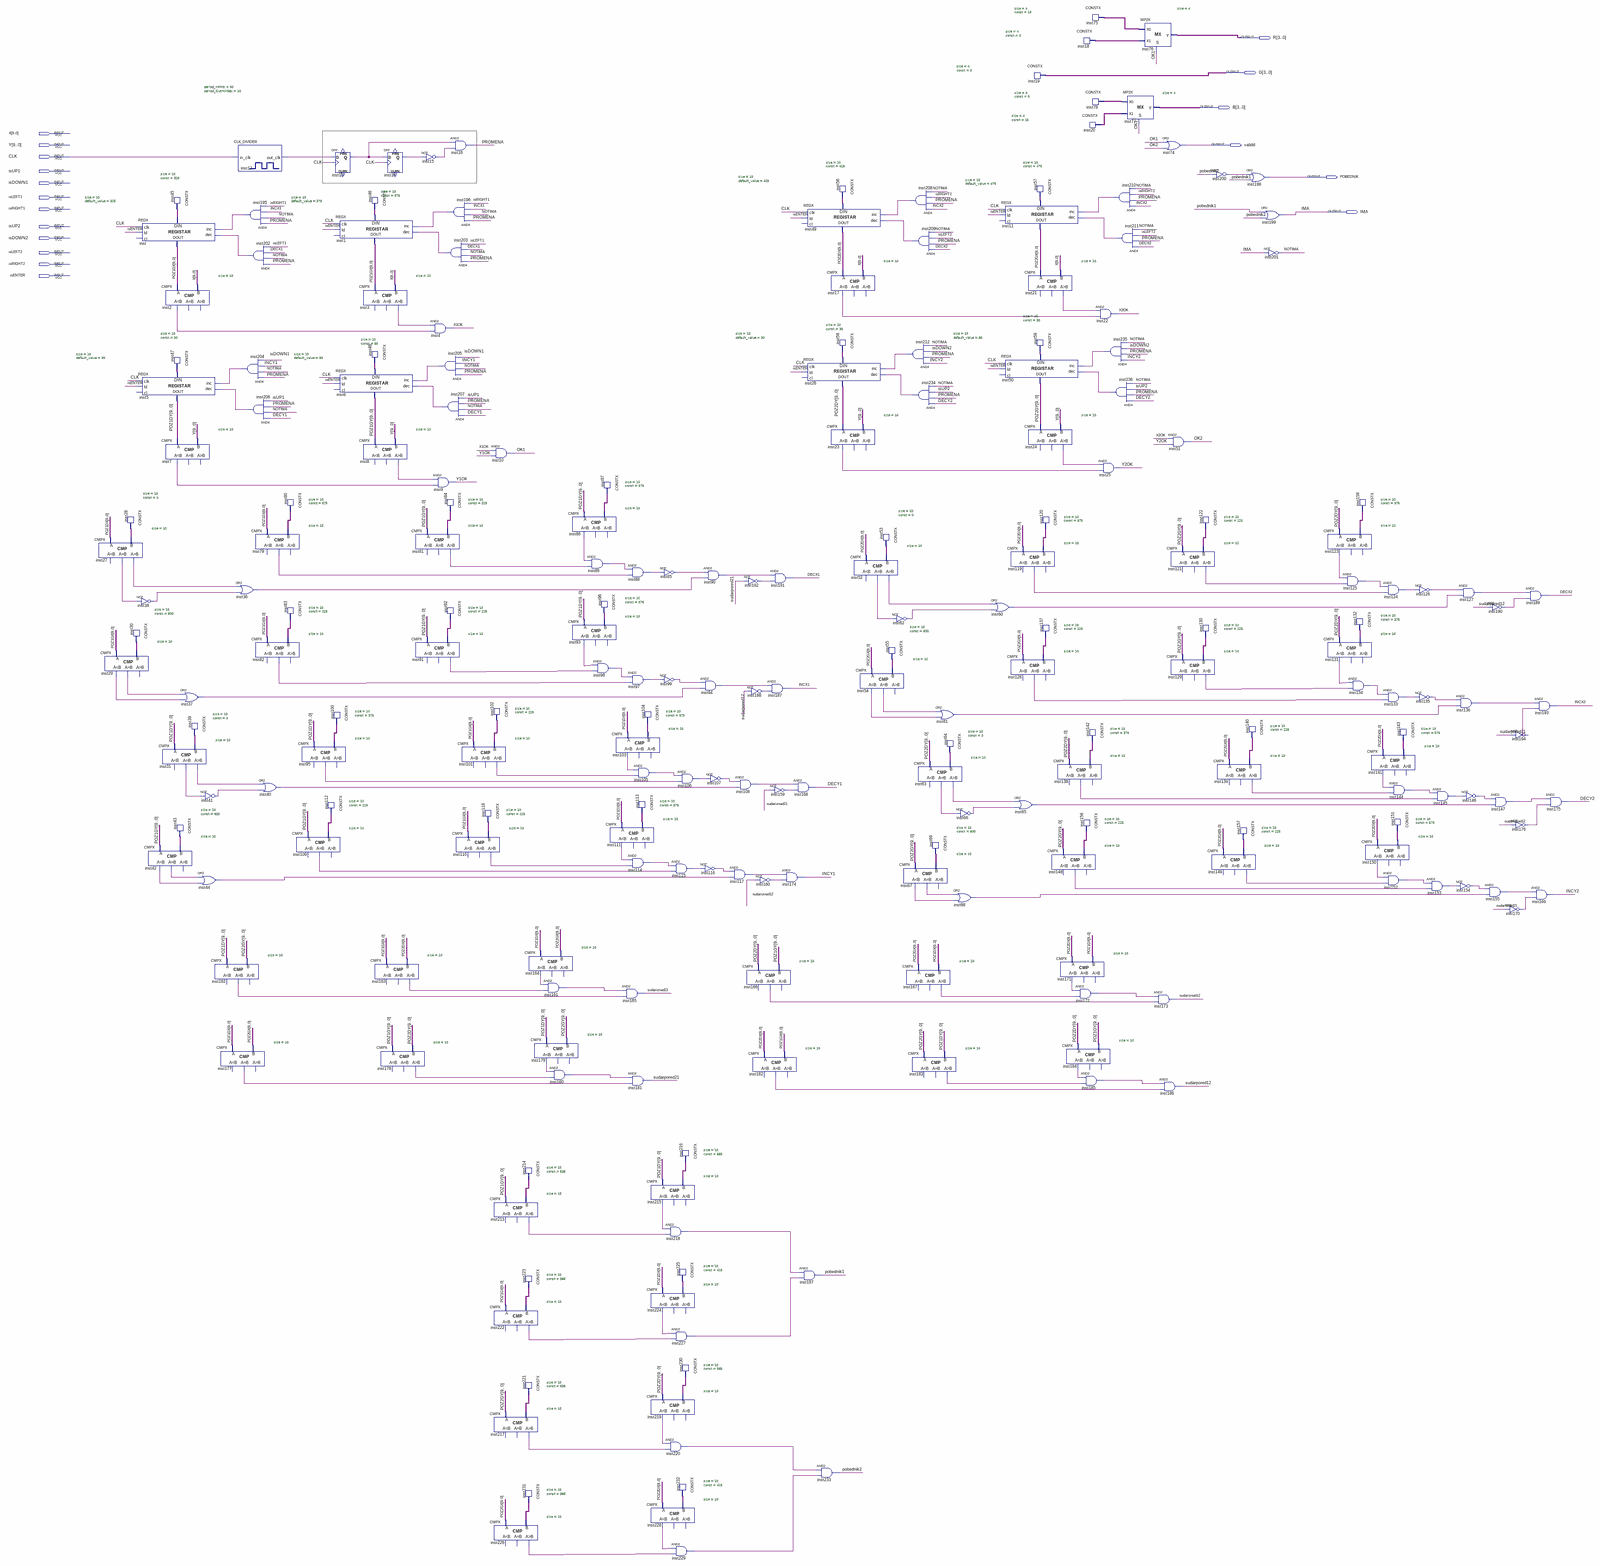
[diagram p0: schematic sheet, whole]
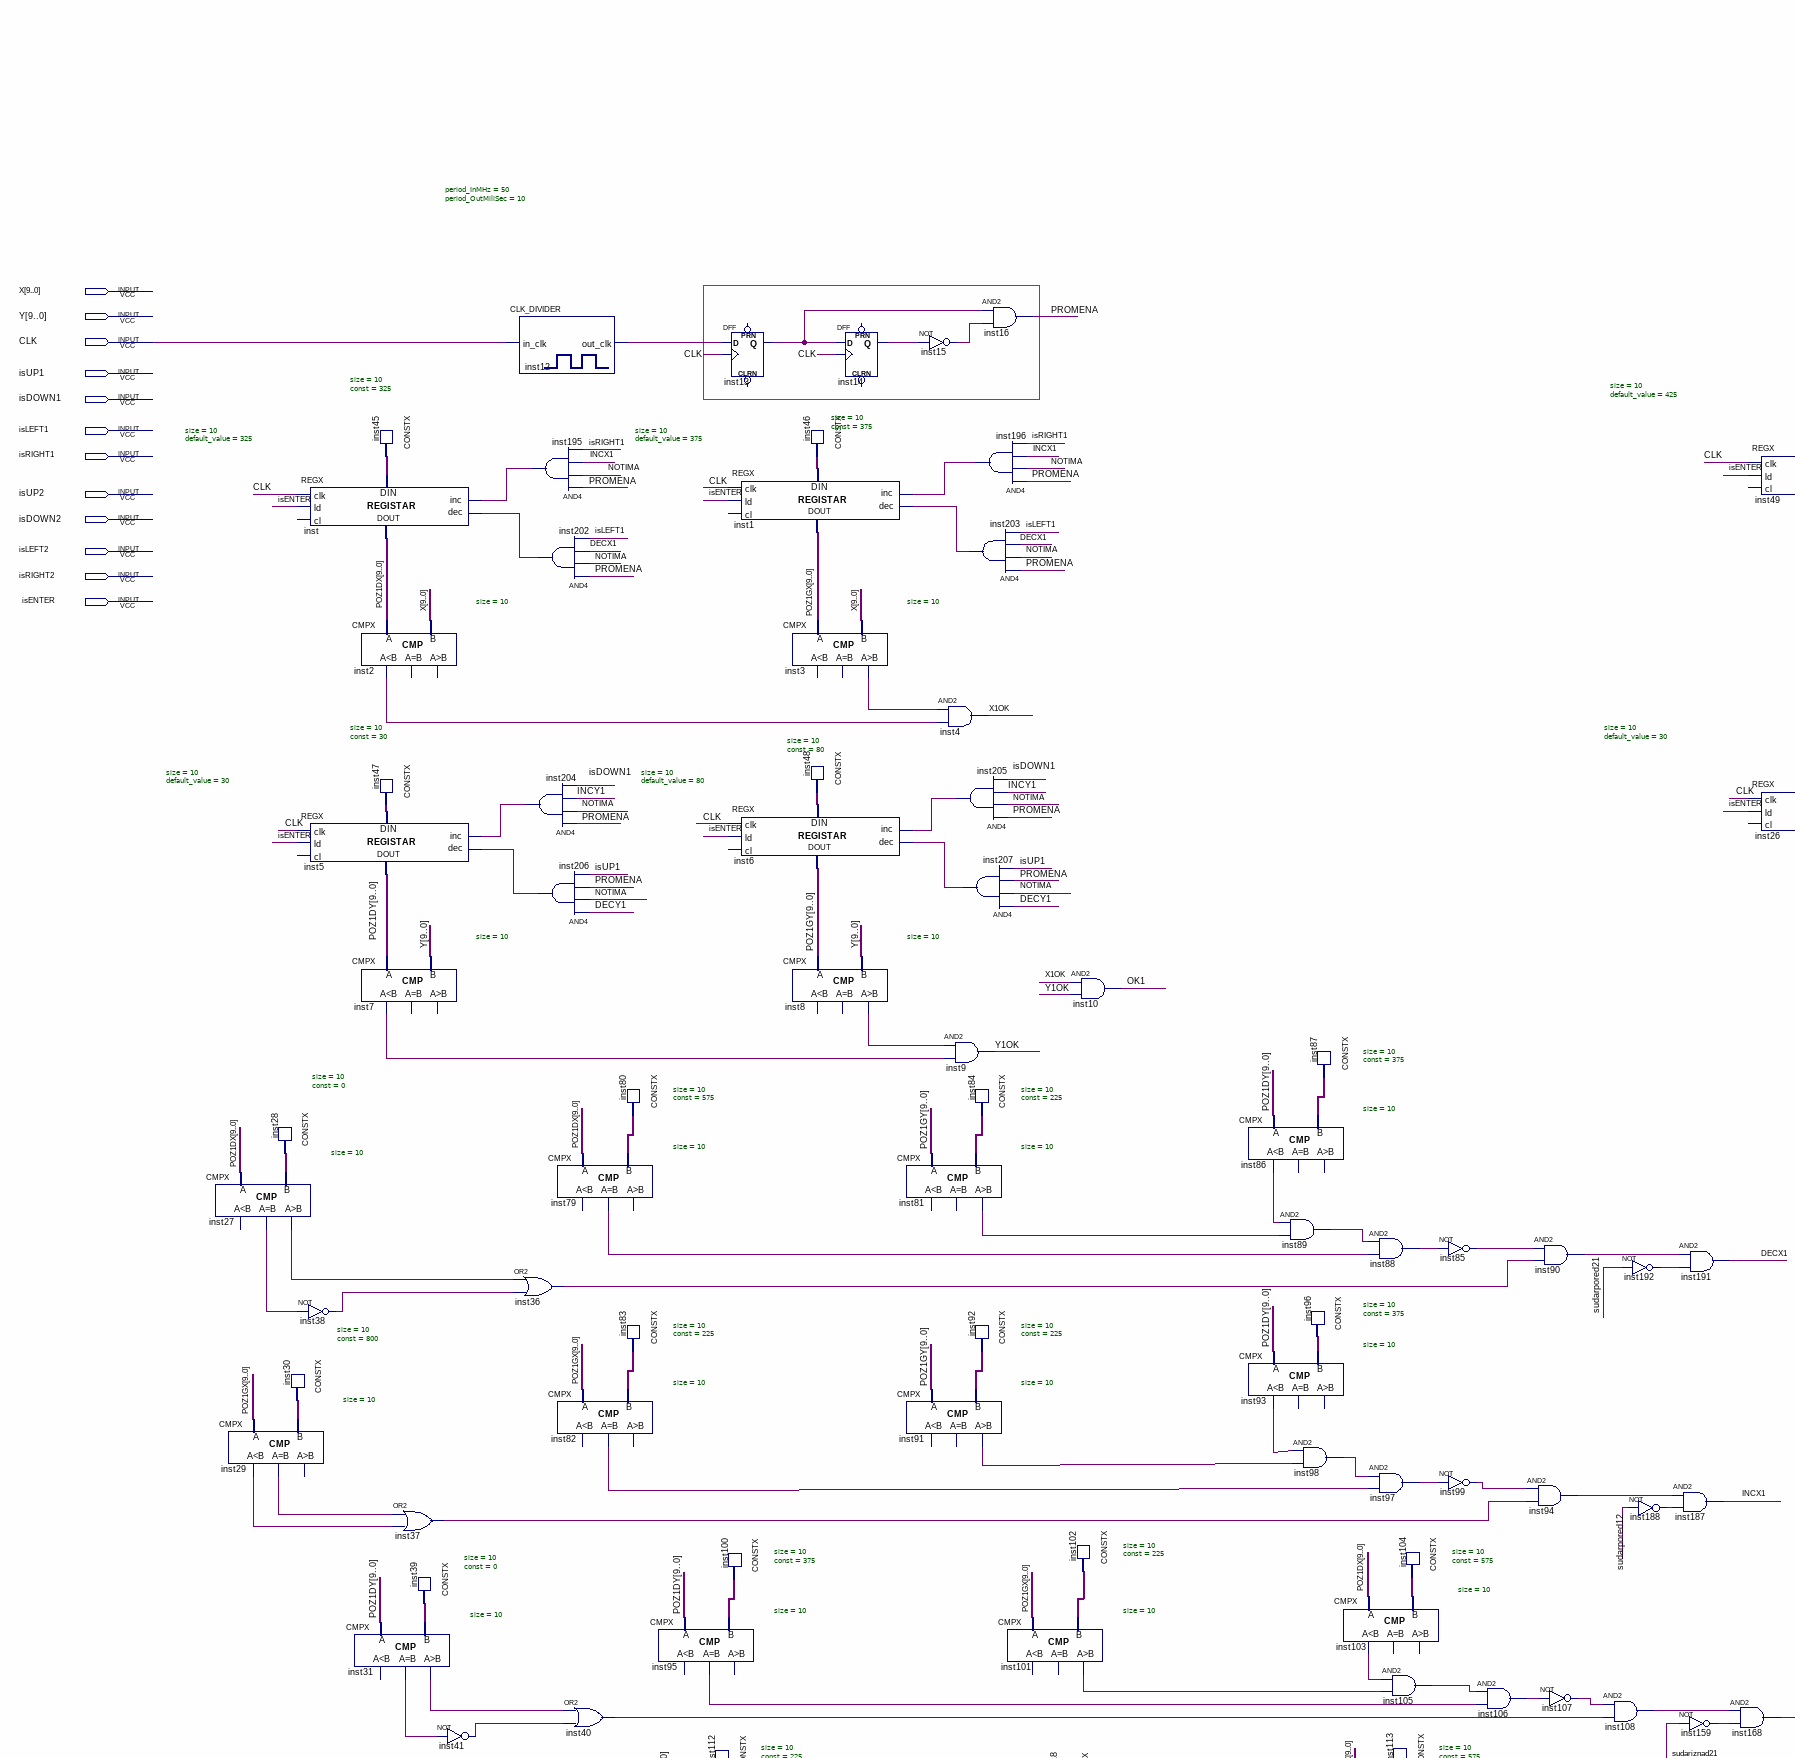
[diagram p1: schematic sheet, upper left part]
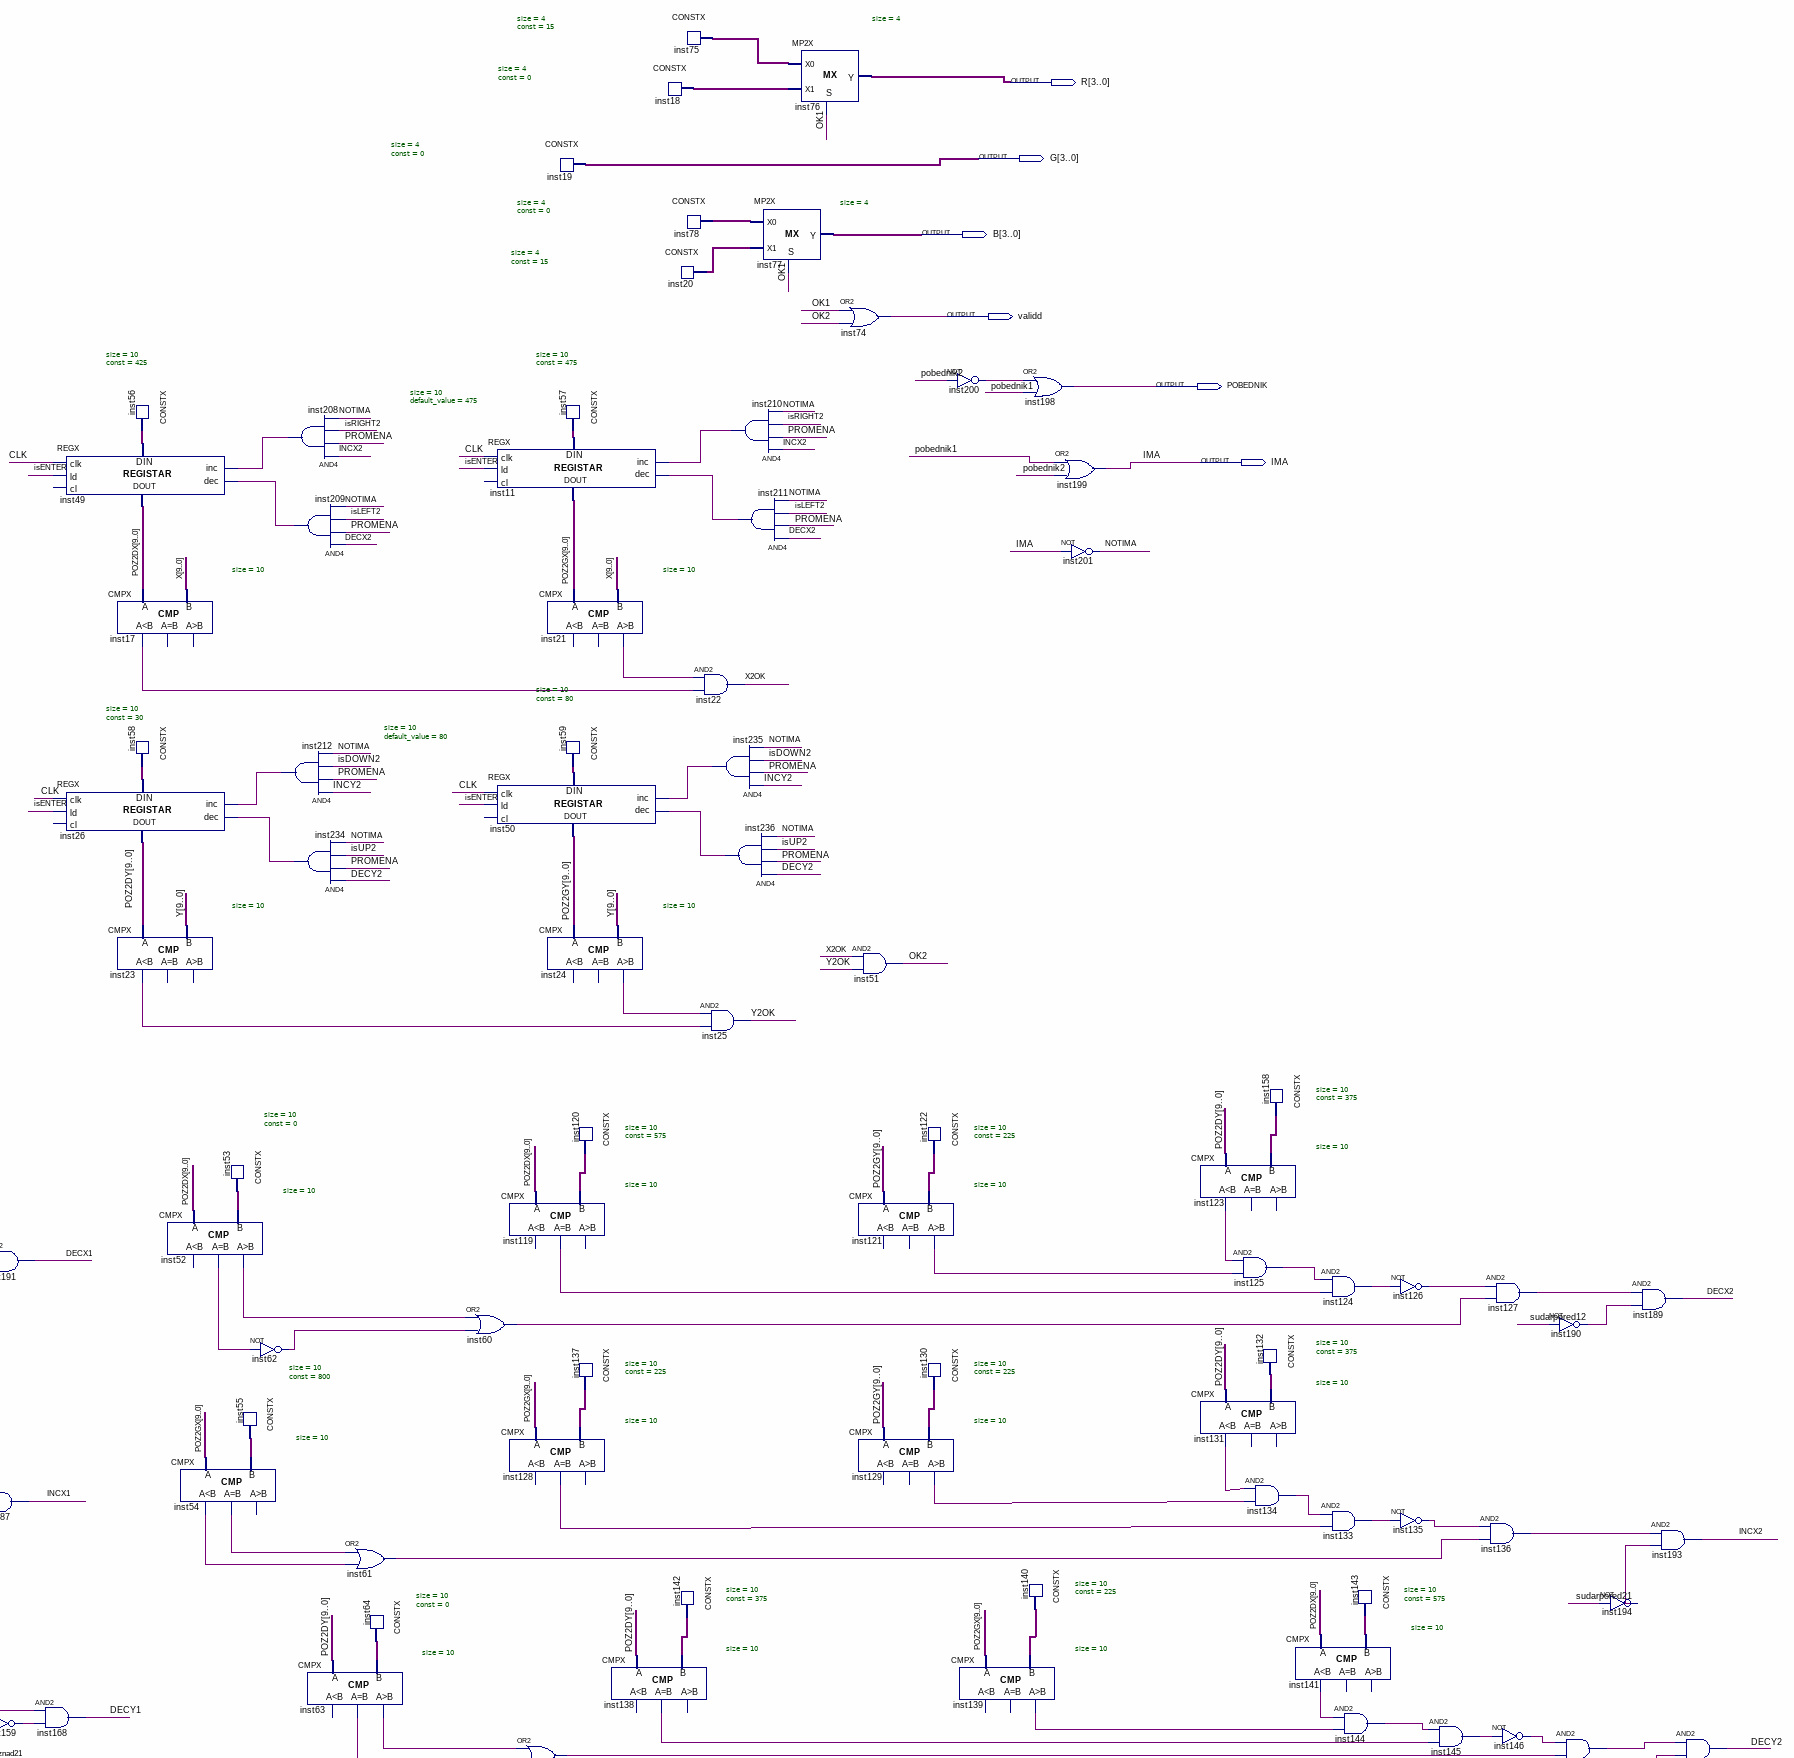
[diagram p2: schematic sheet, upper right part]
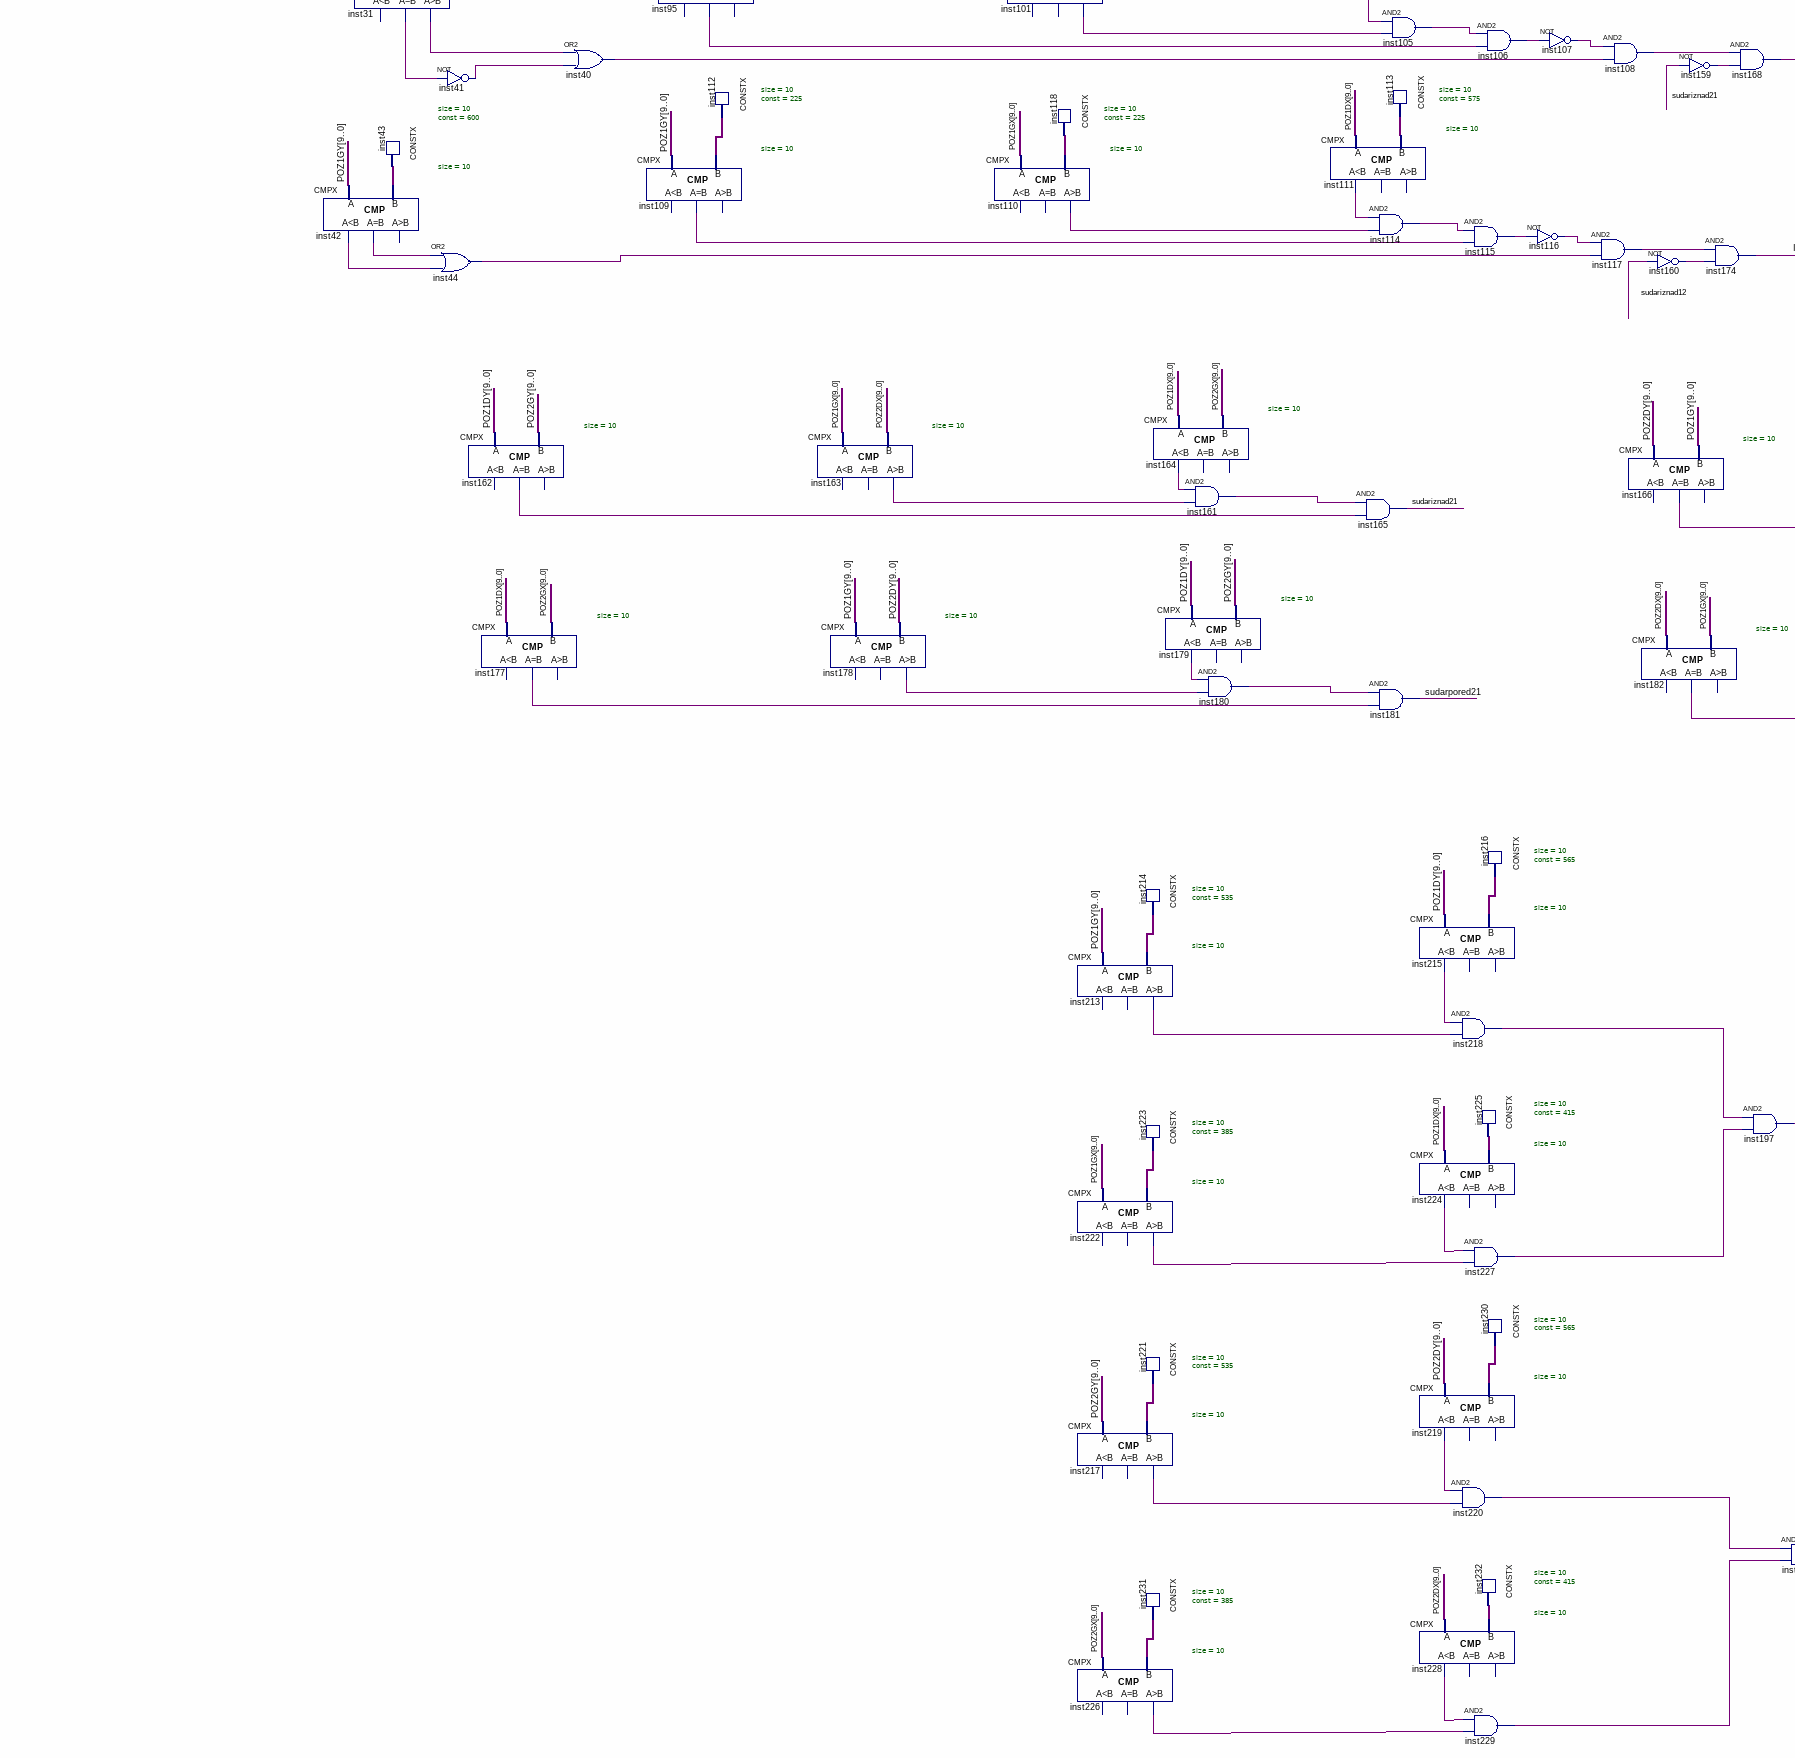
[diagram p3: schematic sheet, lower left part]
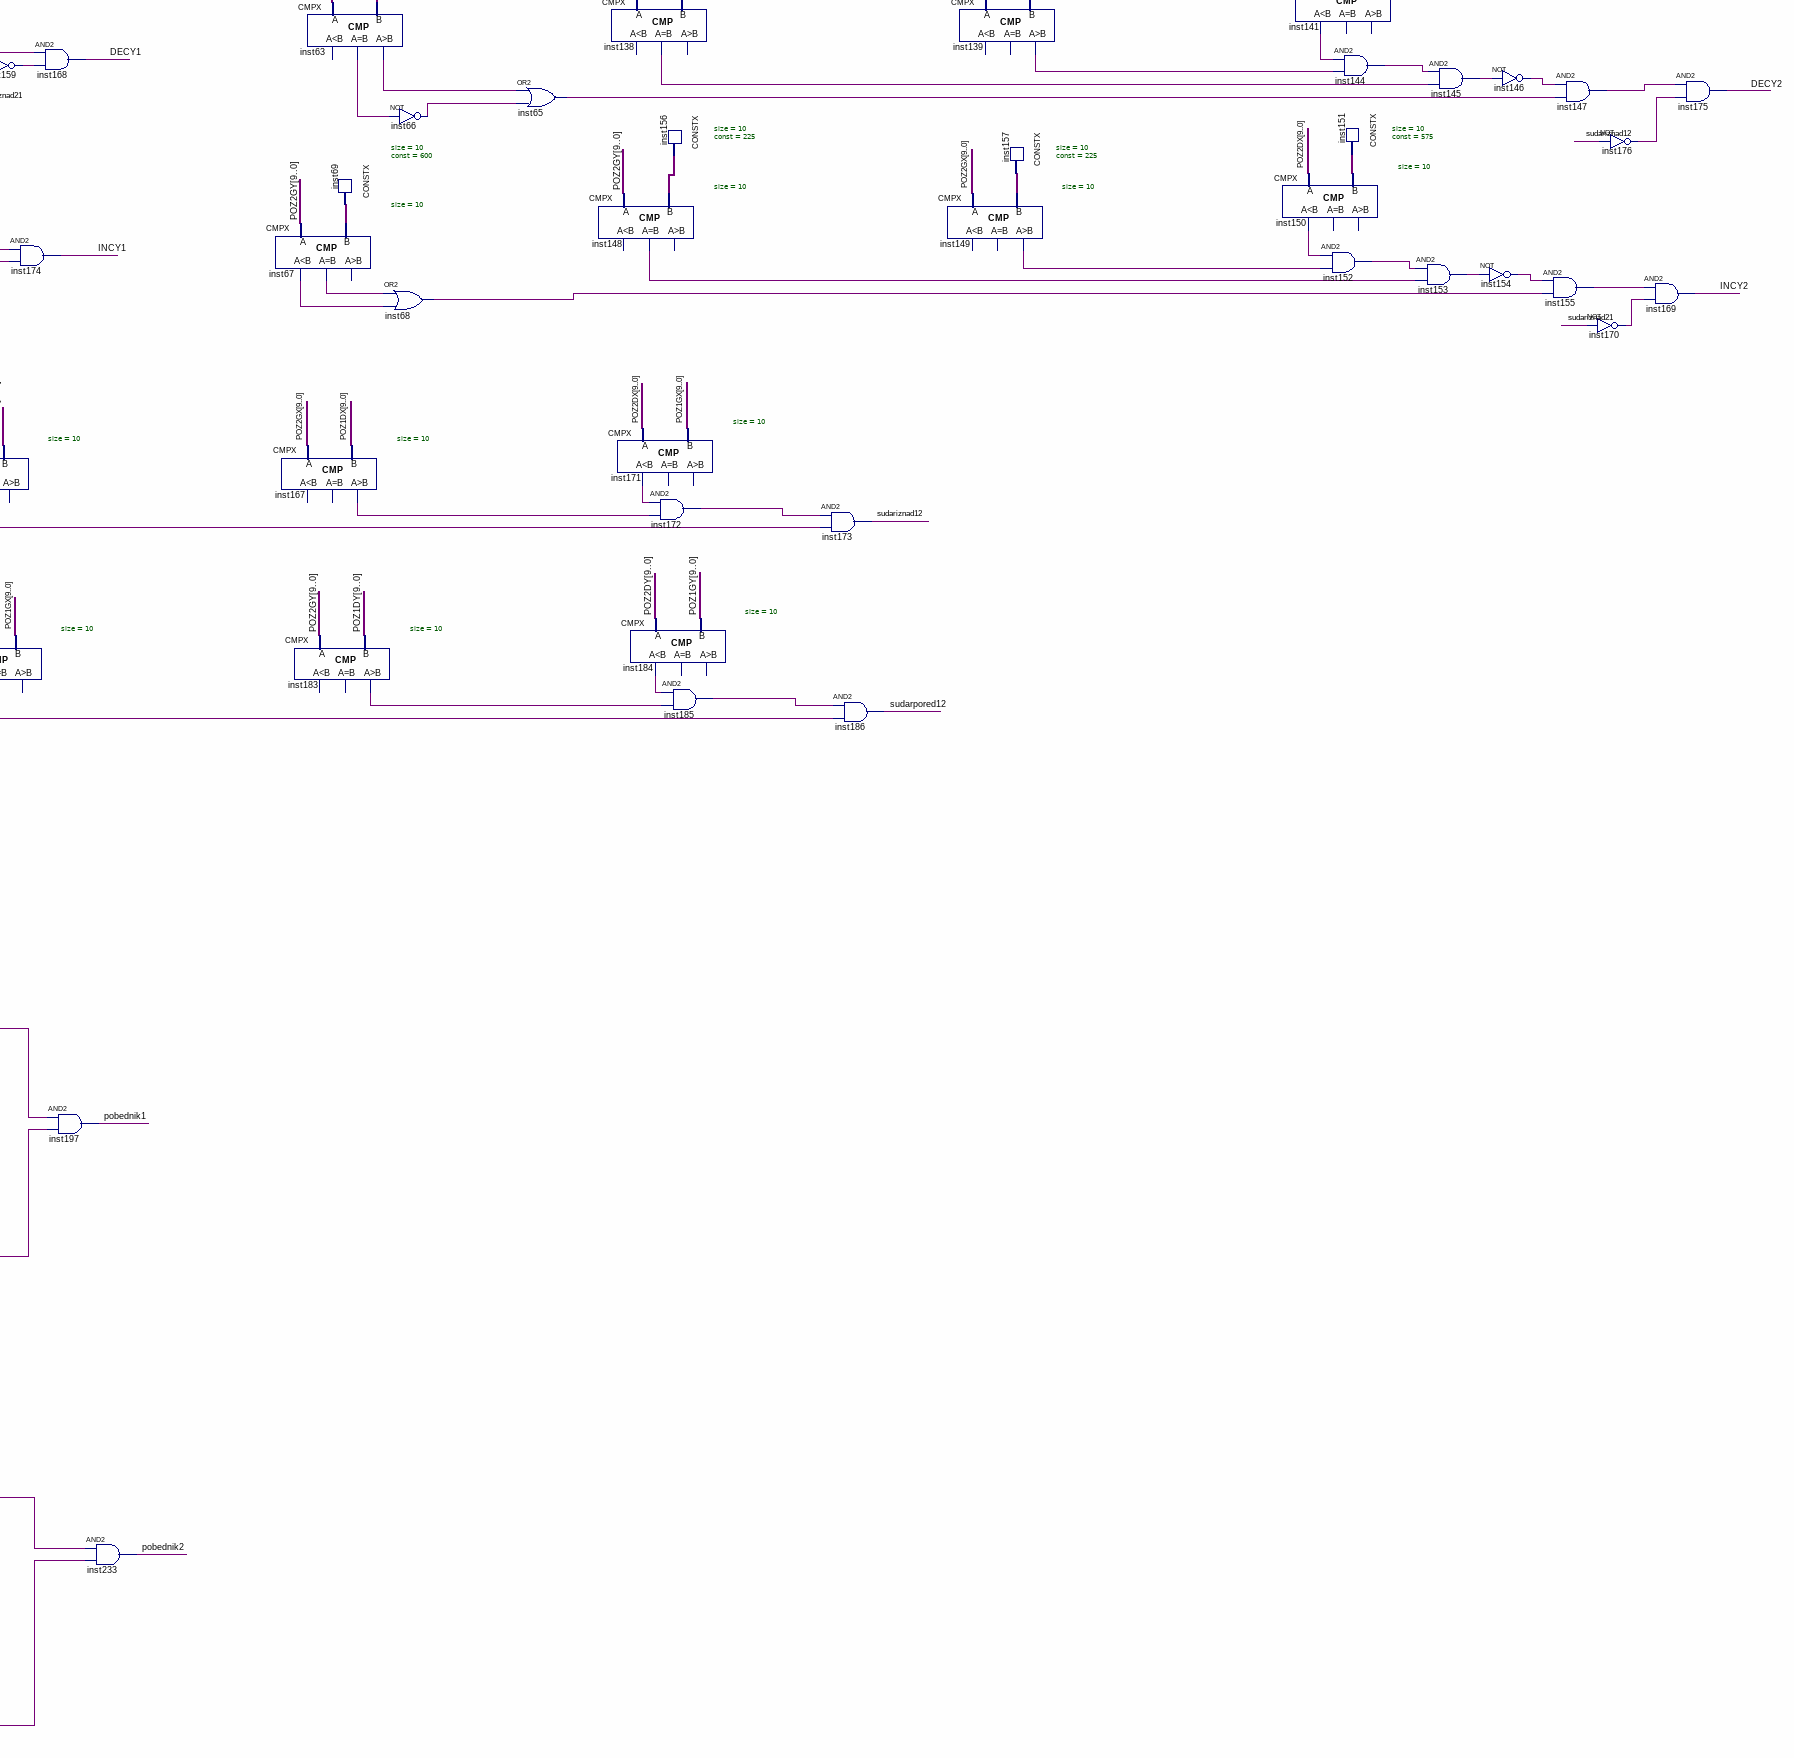
[diagram p4: schematic sheet, lower right part]
// Quartus schematic Layer1.bdf as structural Verilog: 229 symbols, 18 pins
module Layer1 (
  input  [9:0] X,
  input  [9:0] Y,
  input  CLK,
  input  isUP1,
  input  isDOWN1,
  input  isLEFT1,
  input  isRIGHT1,
  input  isUP2,
  input  isDOWN2,
  input  isLEFT2,
  input  isRIGHT2,
  input  isENTER,
  output [3:0] R,
  output [3:0] G,
  output [3:0] B,
  output validd,
  output POBEDNIK,
  output IMA
);

  wire DECX1, DECX2, DECY1, DECY2, INCX1, INCX2, INCY1, INCY2, inst2_ls, inst3_gr, inst7_ls, inst8_gr,
       inst12_out_clk, inst13_q, inst14_q, inst15_out, inst17_ls, inst21_gr, inst23_ls, inst24_gr, inst27_eq,
       inst27_gr, inst29_eq, inst29_ls, inst31_eq, inst31_gr, inst36_out, inst37_out, inst38_out, inst40_out,
       inst41_out, inst42_eq, inst42_ls, inst44_out, inst52_eq, inst52_gr, inst54_eq, inst54_ls, inst60_out,
       inst61_out, inst62_out, inst63_eq, inst63_gr, inst65_out, inst66_out, inst67_eq, inst67_ls,
       inst68_out, inst79_eq, inst81_gr, inst82_eq, inst85_out, inst86_ls, inst88_out, inst89_out,
       inst90_out, inst91_gr, inst93_ls, inst94_out, inst95_eq, inst97_out, inst98_out, inst99_out,
       inst101_gr, inst103_ls, inst105_out, inst106_out, inst107_out, inst108_out, inst109_eq, inst110_gr,
       inst111_ls, inst114_out, inst115_out, inst116_out, inst117_out, inst119_eq, inst121_gr, inst123_ls,
       inst124_out, inst125_out, inst126_out, inst127_out, inst128_eq, inst129_gr, inst131_ls, inst133_out,
       inst134_out, inst135_out, inst136_out, inst138_eq, inst139_gr, inst141_ls, inst144_out, inst145_out,
       inst146_out, inst147_out, inst148_eq, inst149_gr, inst150_ls, inst152_out, inst153_out, inst154_out,
       inst155_out, inst159_out, inst160_out, inst161_out, inst162_eq, inst163_gr, inst164_ls, inst166_eq,
       inst167_gr, inst170_out, inst171_ls, inst172_out, inst176_out, inst177_eq, inst178_gr, inst179_ls,
       inst180_out, inst182_eq, inst183_gr, inst184_ls, inst185_out, inst188_out, inst190_out, inst192_out,
       inst194_out, inst195_out, inst196_out, inst200_out, inst202_out, inst203_out, inst204_out,
       inst205_out, inst206_out, inst207_out, inst208_out, inst209_out, inst210_out, inst211_out,
       inst212_out, inst213_gr, inst215_ls, inst217_gr, inst218_out, inst219_ls, inst220_out, inst222_gr,
       inst224_ls, inst226_gr, inst227_out, inst228_ls, inst229_out, inst234_out, inst235_out, inst236_out,
       NOTIMA, OK1, OK2, pobednik1, pobednik2, PROMENA, sudariznad12, sudariznad21, sudarpored12,
       sudarpored21, X1OK, X2OK, Y1OK, Y2OK;
  wire [3:0] inst18_data, inst20_data, inst75_data, inst78_data;
  wire [9:0] inst28_data, inst30_data, inst39_data, inst43_data, inst45_data, inst46_data, inst47_data,
       inst48_data, inst53_data, inst55_data, inst56_data, inst57_data, inst58_data, inst59_data,
       inst64_data, inst69_data, inst80_data, inst83_data, inst84_data, inst87_data, inst92_data,
       inst96_data, inst100_data, inst102_data, inst104_data, inst112_data, inst113_data, inst118_data,
       inst120_data, inst122_data, inst130_data, inst132_data, inst137_data, inst140_data, inst142_data,
       inst143_data, inst151_data, inst156_data, inst157_data, inst158_data, inst214_data, inst216_data,
       inst221_data, inst223_data, inst225_data, inst230_data, inst231_data, inst232_data, POZ1DX, POZ1DY,
       POZ1GX, POZ1GY, POZ2DX, POZ2DY, POZ2GX, POZ2GY;

  CMPX #(.size(10)) inst27 (.A(POZ1DX), .B(inst28_data), .eq(inst27_eq), .gr(inst27_gr));  // open: ls
  CMPX #(.size(10)) inst29 (.A(POZ1GX), .B(inst30_data), .ls(inst29_ls), .eq(inst29_eq));  // open: gr
  REGX #(.size(10), .default_value(325)) inst (
    .clk(CLK), .ld(isENTER), .inc(inst195_out), .dec(inst202_out), .data_in(inst45_data), .data_out(POZ1DX));  // open: cl
  REGX #(.size(10), .default_value(30)) inst5 (
    .clk(CLK), .ld(isENTER), .inc(inst204_out), .dec(inst206_out), .data_in(inst47_data), .data_out(POZ1DY));  // open: cl
  CONSTX #(.size(10), .\const (0)) inst28 (.data(inst28_data));
  not inst38 (inst38_out, inst27_eq);
  CONSTX #(.size(10), .\const (800)) inst30 (.data(inst30_data));
  CMPX #(.size(10)) inst2 (.A(POZ1DX), .B(X), .ls(inst2_ls));  // open: eq, gr
  CMPX #(.size(10)) inst7 (.A(POZ1DY), .B(Y), .ls(inst7_ls));  // open: eq, gr
  CMPX #(.size(10)) inst31 (.A(POZ1DY), .B(inst39_data), .eq(inst31_eq), .gr(inst31_gr));  // open: ls
  CMPX #(.size(10)) inst42 (.A(POZ1GY), .B(inst43_data), .ls(inst42_ls), .eq(inst42_eq));  // open: gr
  CONSTX #(.size(10), .\const (325)) inst45 (.data(inst45_data));
  CONSTX #(.size(10), .\const (30)) inst47 (.data(inst47_data));
  or inst37 (inst37_out, inst29_eq, inst29_ls);
  CONSTX #(.size(10), .\const (600)) inst43 (.data(inst43_data));
  CONSTX #(.size(10), .\const (0)) inst39 (.data(inst39_data));
  not inst41 (inst41_out, inst31_eq);
  or inst44 (inst44_out, inst42_eq, inst42_ls);
  CMPX #(.size(10)) inst162 (.A(POZ1DY), .B(POZ2GY), .eq(inst162_eq));  // open: ls, gr
  CMPX #(.size(10)) inst177 (.A(POZ1DX), .B(POZ2GX), .eq(inst177_eq));  // open: ls, gr
  CLK_DIVIDER #(.period_InMHz(50), .period_OutMiliSec(10)) inst12 (.in_clk(CLK), .out_clk(inst12_out_clk));
  and inst195 (inst195_out, PROMENA, NOTIMA, INCX1, isRIGHT1);
  and inst202 (inst202_out, PROMENA, NOTIMA, DECX1, isLEFT1);
  and inst204 (inst204_out, PROMENA, NOTIMA, INCY1, isDOWN1);
  and inst206 (inst206_out, DECY1, NOTIMA, PROMENA, isUP1);
  CMPX #(.size(10)) inst79 (.A(POZ1DX), .B(inst80_data), .eq(inst79_eq));  // open: ls, gr
  or inst36 (inst36_out, inst27_gr, inst38_out);
  CMPX #(.size(10)) inst82 (.A(POZ1GX), .B(inst83_data), .eq(inst82_eq));  // open: ls, gr
  or inst40 (inst40_out, inst31_gr, inst41_out);
  CONSTX #(.size(10), .\const (575)) inst80 (.data(inst80_data));
  CONSTX #(.size(10), .\const (225)) inst83 (.data(inst83_data));
  CMPX #(.size(10)) inst95 (.A(POZ1DY), .B(inst100_data), .eq(inst95_eq));  // open: ls, gr
  CMPX #(.size(10)) inst109 (.A(POZ1GY), .B(inst112_data), .eq(inst109_eq));  // open: ls, gr
  CONSTX #(.size(10), .\const (225)) inst112 (.data(inst112_data));
  DFF inst13 (.CLK(CLK), .D(inst12_out_clk), .Q(inst13_q));  // open: CLRN, PRN
  REGX #(.size(10), .default_value(375)) inst1 (
    .clk(CLK), .ld(isENTER), .inc(inst196_out), .dec(inst203_out), .data_in(inst46_data), .data_out(POZ1GX));  // open: cl
  REGX #(.size(10), .default_value(80)) inst6 (
    .clk(CLK), .ld(isENTER), .inc(inst205_out), .dec(inst207_out), .data_in(inst48_data), .data_out(POZ1GY));  // open: cl
  CONSTX #(.size(10), .\const (375)) inst100 (.data(inst100_data));
  CONSTX #(.size(10), .\const (375)) inst46 (.data(inst46_data));
  CMPX #(.size(10)) inst3 (.A(POZ1GX), .B(X), .gr(inst3_gr));  // open: ls, eq
  CONSTX #(.size(10), .\const (80)) inst48 (.data(inst48_data));
  CMPX #(.size(10)) inst8 (.A(POZ1GY), .B(Y), .gr(inst8_gr));  // open: ls, eq
  CMPX #(.size(10)) inst163 (.A(POZ1GX), .B(POZ2DX), .gr(inst163_gr));  // open: ls, eq
  DFF inst14 (.CLK(CLK), .D(inst13_q), .Q(inst14_q));  // open: CLRN, PRN
  CMPX #(.size(10)) inst178 (.A(POZ1GY), .B(POZ2DY), .gr(inst178_gr));  // open: ls, eq
  CMPX #(.size(10)) inst81 (.A(POZ1GY), .B(inst84_data), .gr(inst81_gr));  // open: ls, eq
  CMPX #(.size(10)) inst91 (.A(POZ1GY), .B(inst92_data), .gr(inst91_gr));  // open: ls, eq
  not inst15 (inst15_out, inst14_q);
  and inst4 (X1OK, inst3_gr, inst2_ls);
  and inst205 (inst205_out, PROMENA, NOTIMA, INCY1, isDOWN1);
  and inst9 (Y1OK, inst8_gr, inst7_ls);
  and inst16 (PROMENA, inst13_q, inst15_out);
  and inst196 (inst196_out, PROMENA, NOTIMA, INCX1, isRIGHT1);
  and inst203 (inst203_out, PROMENA, NOTIMA, DECX1, isLEFT1);
  and inst207 (inst207_out, DECY1, NOTIMA, PROMENA, isUP1);
  CONSTX #(.size(10), .\const (225)) inst84 (.data(inst84_data));
  CONSTX #(.size(10), .\const (225)) inst92 (.data(inst92_data));
  CMPX #(.size(10)) inst101 (.A(POZ1GX), .B(inst102_data), .gr(inst101_gr));  // open: ls, eq
  CMPX #(.size(10)) inst110 (.A(POZ1GX), .B(inst118_data), .gr(inst110_gr));  // open: ls, eq
  CONSTX #(.size(10), .\const (225)) inst118 (.data(inst118_data));
  and inst10 (OK1, X1OK, Y1OK);
  CONSTX #(.size(10), .\const (225)) inst102 (.data(inst102_data));
  CMPX #(.size(10)) inst213 (.A(POZ1GY), .B(inst214_data), .gr(inst213_gr));  // open: ls, eq
  CMPX #(.size(10)) inst222 (.A(POZ1GX), .B(inst223_data), .gr(inst222_gr));  // open: ls, eq
  CMPX #(.size(10)) inst217 (.A(POZ2GY), .B(inst221_data), .gr(inst217_gr));  // open: ls, eq
  CMPX #(.size(10)) inst226 (.A(POZ2GX), .B(inst231_data), .gr(inst226_gr));  // open: ls, eq
  CMPX #(.size(10)) inst164 (.A(POZ1DX), .B(POZ2GX), .ls(inst164_ls));  // open: eq, gr
  CMPX #(.size(10)) inst179 (.A(POZ1DY), .B(POZ2GY), .ls(inst179_ls));  // open: eq, gr
  CONSTX #(.size(10), .\const (535)) inst214 (.data(inst214_data));
  CONSTX #(.size(10), .\const (385)) inst223 (.data(inst223_data));
  CONSTX #(.size(10), .\const (535)) inst221 (.data(inst221_data));
  CONSTX #(.size(10), .\const (385)) inst231 (.data(inst231_data));
  and inst161 (inst161_out, inst164_ls, inst163_gr);
  and inst180 (inst180_out, inst179_ls, inst178_gr);
  CMPX #(.size(10)) inst86 (.A(POZ1DY), .B(inst87_data), .ls(inst86_ls));  // open: eq, gr
  CMPX #(.size(10)) inst93 (.A(POZ1DY), .B(inst96_data), .ls(inst93_ls));  // open: eq, gr
  CONSTX #(.size(10), .\const (375)) inst87 (.data(inst87_data));
  and inst89 (inst89_out, inst86_ls, inst81_gr);
  CONSTX #(.size(10), .\const (375)) inst96 (.data(inst96_data));
  and inst98 (inst98_out, inst93_ls, inst91_gr);
  CMPX #(.size(10)) inst103 (.A(POZ1DX), .B(inst104_data), .ls(inst103_ls));  // open: eq, gr
  CMPX #(.size(10)) inst111 (.A(POZ1DX), .B(inst113_data), .ls(inst111_ls));  // open: eq, gr
  and inst165 (sudariznad21, inst161_out, inst162_eq);
  and inst88 (inst88_out, inst89_out, inst79_eq);
  and inst97 (inst97_out, inst98_out, inst82_eq);
  CONSTX #(.size(10), .\const (575)) inst104 (.data(inst104_data));
  and inst105 (inst105_out, inst103_ls, inst101_gr);
  CONSTX #(.size(10), .\const (575)) inst113 (.data(inst113_data));
  and inst114 (inst114_out, inst111_ls, inst110_gr);
  and inst181 (sudarpored21, inst180_out, inst177_eq);
  CMPX #(.size(10)) inst215 (.A(POZ1DY), .B(inst216_data), .ls(inst215_ls));  // open: eq, gr
  CMPX #(.size(10)) inst224 (.A(POZ1DX), .B(inst225_data), .ls(inst224_ls));  // open: eq, gr
  CMPX #(.size(10)) inst219 (.A(POZ2DY), .B(inst230_data), .ls(inst219_ls));  // open: eq, gr
  CMPX #(.size(10)) inst228 (.A(POZ2DX), .B(inst232_data), .ls(inst228_ls));  // open: eq, gr
  not inst85 (inst85_out, inst88_out);
  not inst99 (inst99_out, inst97_out);
  and inst115 (inst115_out, inst114_out, inst109_eq);
  and inst218 (inst218_out, inst215_ls, inst213_gr);
  and inst227 (inst227_out, inst224_ls, inst222_gr);
  and inst220 (inst220_out, inst219_ls, inst217_gr);
  and inst229 (inst229_out, inst228_ls, inst226_gr);
  and inst106 (inst106_out, inst105_out, inst95_eq);
  CONSTX #(.size(10), .\const (565)) inst216 (.data(inst216_data));
  CONSTX #(.size(10), .\const (415)) inst225 (.data(inst225_data));
  CONSTX #(.size(10), .\const (565)) inst230 (.data(inst230_data));
  CONSTX #(.size(10), .\const (415)) inst232 (.data(inst232_data));
  and inst90 (inst90_out, inst85_out, inst36_out);
  and inst94 (inst94_out, inst99_out, inst37_out);
  not inst107 (inst107_out, inst106_out);
  not inst116 (inst116_out, inst115_out);
  and inst108 (inst108_out, inst107_out, inst40_out);
  and inst117 (inst117_out, inst116_out, inst44_out);
  CMPX #(.size(10)) inst166 (.A(POZ2DY), .B(POZ1GY), .eq(inst166_eq));  // open: ls, gr
  not inst192 (inst192_out, sudarpored21);
  not inst188 (inst188_out, sudarpored12);
  not inst160 (inst160_out, sudariznad12);
  CMPX #(.size(10)) inst182 (.A(POZ2DX), .B(POZ1GX), .eq(inst182_eq));  // open: ls, gr
  and inst191 (DECX1, inst90_out, inst192_out);
  and inst187 (INCX1, inst94_out, inst188_out);
  not inst159 (inst159_out, sudariznad21);
  and inst174 (INCY1, inst117_out, inst160_out);
  REGX #(.size(10), .default_value(425)) inst49 (
    .clk(CLK), .ld(isENTER), .inc(inst208_out), .dec(inst209_out), .data_in(inst56_data), .data_out(POZ2DX));  // open: cl
  REGX #(.size(10), .default_value(30)) inst26 (
    .clk(CLK), .ld(isENTER), .inc(inst212_out), .dec(inst234_out), .data_in(inst58_data), .data_out(POZ2DY));  // open: cl
  and inst168 (DECY1, inst108_out, inst159_out);
  and inst197 (pobednik1, inst218_out, inst227_out);
  CONSTX #(.size(10), .\const (425)) inst56 (.data(inst56_data));
  CMPX #(.size(10)) inst17 (.A(POZ2DX), .B(X), .ls(inst17_ls));  // open: eq, gr
  CONSTX #(.size(10), .\const (30)) inst58 (.data(inst58_data));
  CMPX #(.size(10)) inst23 (.A(POZ2DY), .B(Y), .ls(inst23_ls));  // open: eq, gr
  and inst233 (pobednik2, inst220_out, inst229_out);
  CMPX #(.size(10)) inst52 (.A(POZ2DX), .B(inst53_data), .eq(inst52_eq), .gr(inst52_gr));  // open: ls
  CMPX #(.size(10)) inst54 (.A(POZ2GX), .B(inst55_data), .ls(inst54_ls), .eq(inst54_eq));  // open: gr
  CONSTX #(.size(10), .\const (0)) inst53 (.data(inst53_data));
  not inst62 (inst62_out, inst52_eq);
  CONSTX #(.size(10), .\const (800)) inst55 (.data(inst55_data));
  CMPX #(.size(10)) inst67 (.A(POZ2GY), .B(inst69_data), .ls(inst67_ls), .eq(inst67_eq));  // open: gr
  CMPX #(.size(10)) inst167 (.A(POZ2GX), .B(POZ1DX), .gr(inst167_gr));  // open: ls, eq
  and inst208 (inst208_out, INCX2, PROMENA, isRIGHT2, NOTIMA);
  and inst209 (inst209_out, DECX2, PROMENA, isLEFT2, NOTIMA);
  and inst212 (inst212_out, INCY2, PROMENA, isDOWN2, NOTIMA);
  and inst234 (inst234_out, DECY2, PROMENA, isUP2, NOTIMA);
  CMPX #(.size(10)) inst63 (.A(POZ2DY), .B(inst64_data), .eq(inst63_eq), .gr(inst63_gr));  // open: ls
  CONSTX #(.size(10), .\const (600)) inst69 (.data(inst69_data));
  CMPX #(.size(10)) inst183 (.A(POZ2GY), .B(POZ1DY), .gr(inst183_gr));  // open: ls, eq
  or inst61 (inst61_out, inst54_eq, inst54_ls);
  CONSTX #(.size(10), .\const (0)) inst64 (.data(inst64_data));
  not inst66 (inst66_out, inst63_eq);
  or inst68 (inst68_out, inst67_eq, inst67_ls);
  or inst60 (inst60_out, inst52_gr, inst62_out);
  REGX #(.size(10), .default_value(475)) inst11 (
    .clk(CLK), .ld(isENTER), .inc(inst210_out), .dec(inst211_out), .data_in(inst57_data), .data_out(POZ2GX));  // open: cl
  REGX #(.size(10), .default_value(80)) inst50 (
    .clk(CLK), .ld(isENTER), .inc(inst235_out), .dec(inst236_out), .data_in(inst59_data), .data_out(POZ2GY));  // open: cl
  CMPX #(.size(10)) inst119 (.A(POZ2DX), .B(inst120_data), .eq(inst119_eq));  // open: ls, gr
  CMPX #(.size(10)) inst128 (.A(POZ2GX), .B(inst137_data), .eq(inst128_eq));  // open: ls, gr
  or inst65 (inst65_out, inst63_gr, inst66_out);
  CONSTX #(.size(4), .\const (0)) inst19 (.data(G));
  CONSTX #(.size(10), .\const (475)) inst57 (.data(inst57_data));
  CMPX #(.size(10)) inst21 (.A(POZ2GX), .B(X), .gr(inst21_gr));  // open: ls, eq
  CONSTX #(.size(10), .\const (80)) inst59 (.data(inst59_data));
  CMPX #(.size(10)) inst24 (.A(POZ2GY), .B(Y), .gr(inst24_gr));  // open: ls, eq
  CONSTX #(.size(10), .\const (575)) inst120 (.data(inst120_data));
  CONSTX #(.size(10), .\const (225)) inst137 (.data(inst137_data));
  CMPX #(.size(10)) inst138 (.A(POZ2DY), .B(inst142_data), .eq(inst138_eq));  // open: ls, gr
  CMPX #(.size(10)) inst148 (.A(POZ2GY), .B(inst156_data), .eq(inst148_eq));  // open: ls, gr
  CMPX #(.size(10)) inst171 (.A(POZ2DX), .B(POZ1GX), .ls(inst171_ls));  // open: eq, gr
  CMPX #(.size(10)) inst184 (.A(POZ2DY), .B(POZ1GY), .ls(inst184_ls));  // open: eq, gr
  CONSTX #(.size(4), .\const (15)) inst75 (.data(inst75_data));
  CONSTX #(.size(4), .\const (0)) inst18 (.data(inst18_data));
  CONSTX #(.size(4), .\const (0)) inst78 (.data(inst78_data));
  CONSTX #(.size(4), .\const (15)) inst20 (.data(inst20_data));
  CONSTX #(.size(10), .\const (375)) inst142 (.data(inst142_data));
  CONSTX #(.size(10), .\const (225)) inst156 (.data(inst156_data));
  and inst172 (inst172_out, inst171_ls, inst167_gr);
  and inst185 (inst185_out, inst184_ls, inst183_gr);
  and inst210 (inst210_out, INCX2, PROMENA, isRIGHT2, NOTIMA);
  and inst22 (X2OK, inst21_gr, inst17_ls);
  and inst235 (inst235_out, INCY2, PROMENA, isDOWN2, NOTIMA);
  and inst236 (inst236_out, DECY2, PROMENA, isUP2, NOTIMA);
  and inst25 (Y2OK, inst24_gr, inst23_ls);
  MP2X #(.size(4)) inst77 (.S(OK1), .X0(inst78_data), .X1(inst20_data), .Y(B));
  and inst211 (inst211_out, DECX2, PROMENA, isLEFT2, NOTIMA);
  MP2X #(.size(4)) inst76 (.S(OK1), .X0(inst75_data), .X1(inst18_data), .Y(R));
  and inst173 (sudariznad12, inst172_out, inst166_eq);
  and inst186 (sudarpored12, inst185_out, inst182_eq);
  or inst74 (validd, OK1, OK2);
  and inst51 (OK2, X2OK, Y2OK);
  CMPX #(.size(10)) inst121 (.A(POZ2GY), .B(inst122_data), .gr(inst121_gr));  // open: ls, eq
  CMPX #(.size(10)) inst129 (.A(POZ2GY), .B(inst130_data), .gr(inst129_gr));  // open: ls, eq
  CONSTX #(.size(10), .\const (225)) inst122 (.data(inst122_data));
  CONSTX #(.size(10), .\const (225)) inst130 (.data(inst130_data));
  CMPX #(.size(10)) inst149 (.A(POZ2GX), .B(inst157_data), .gr(inst149_gr));  // open: ls, eq
  not inst200 (inst200_out, pobednik2);
  CMPX #(.size(10)) inst139 (.A(POZ2GX), .B(inst140_data), .gr(inst139_gr));  // open: ls, eq
  or inst198 (POBEDNIK, inst200_out, pobednik1);
  CONSTX #(.size(10), .\const (225)) inst140 (.data(inst140_data));
  CONSTX #(.size(10), .\const (225)) inst157 (.data(inst157_data));
  or inst199 (IMA, pobednik1, pobednik2);
  not inst201 (NOTIMA, IMA);
  CMPX #(.size(10)) inst123 (.A(POZ2DY), .B(inst158_data), .ls(inst123_ls));  // open: eq, gr
  CMPX #(.size(10)) inst131 (.A(POZ2DY), .B(inst132_data), .ls(inst131_ls));  // open: eq, gr
  and inst125 (inst125_out, inst123_ls, inst121_gr);
  CONSTX #(.size(10), .\const (375)) inst158 (.data(inst158_data));
  CONSTX #(.size(10), .\const (375)) inst132 (.data(inst132_data));
  and inst134 (inst134_out, inst131_ls, inst129_gr);
  CMPX #(.size(10)) inst141 (.A(POZ2DX), .B(inst143_data), .ls(inst141_ls));  // open: eq, gr
  CMPX #(.size(10)) inst150 (.A(POZ2DX), .B(inst151_data), .ls(inst150_ls));  // open: eq, gr
  and inst124 (inst124_out, inst125_out, inst119_eq);
  and inst133 (inst133_out, inst134_out, inst128_eq);
  and inst144 (inst144_out, inst141_ls, inst139_gr);
  CONSTX #(.size(10), .\const (575)) inst151 (.data(inst151_data));
  and inst152 (inst152_out, inst150_ls, inst149_gr);
  not inst126 (inst126_out, inst124_out);
  not inst135 (inst135_out, inst133_out);
  CONSTX #(.size(10), .\const (575)) inst143 (.data(inst143_data));
  and inst145 (inst145_out, inst144_out, inst138_eq);
  and inst153 (inst153_out, inst152_out, inst148_eq);
  and inst127 (inst127_out, inst126_out, inst60_out);
  and inst136 (inst136_out, inst135_out, inst61_out);
  not inst146 (inst146_out, inst145_out);
  not inst154 (inst154_out, inst153_out);
  and inst155 (inst155_out, inst154_out, inst68_out);
  not inst190 (inst190_out, sudarpored12);
  and inst147 (inst147_out, inst146_out, inst65_out);
  not inst170 (inst170_out, sudariznad21);
  and inst189 (DECX2, inst127_out, inst190_out);
  not inst194 (inst194_out, sudarpored21);
  not inst176 (inst176_out, sudariznad12);
  and inst169 (INCY2, inst155_out, inst170_out);
  and inst193 (INCX2, inst136_out, inst194_out);
  and inst175 (DECY2, inst147_out, inst176_out);
endmodule
